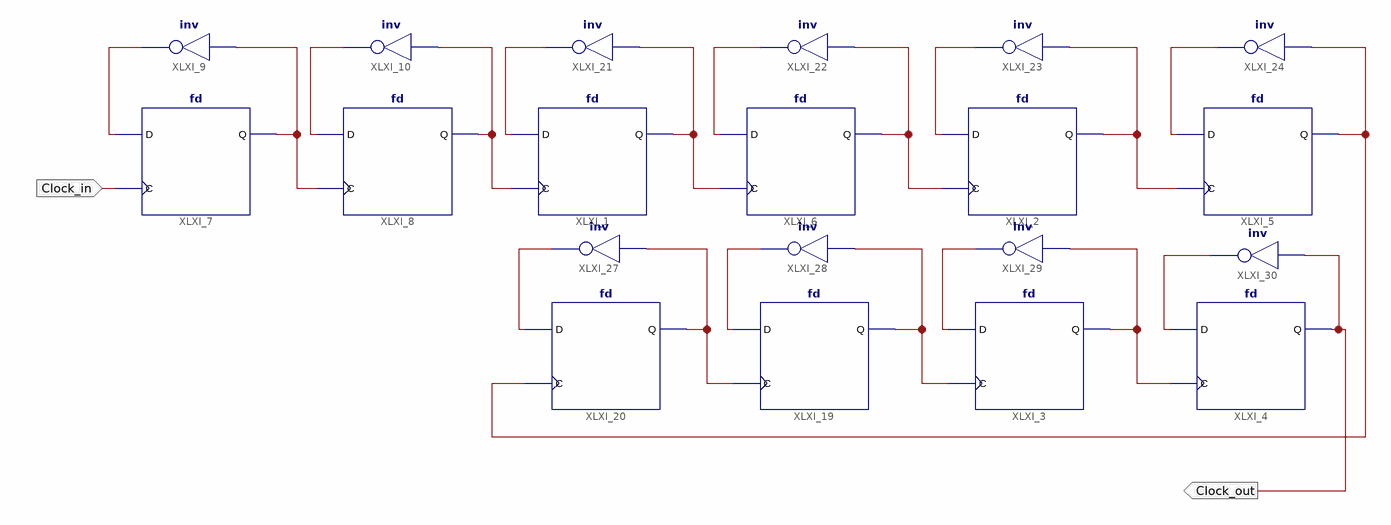
[diagram p0: schematic sheet 1]
// Xilinx ISE schematic CD3.sch (spartan6) as structural Verilog: 20 symbols, 2 ports
module CD3 (
  input  Clock_in,
  output Clock_out
);

  wire XLXN_1, XLXN_2, XLXN_3, XLXN_4, XLXN_5, XLXN_6, XLXN_7, XLXN_18, XLXN_29, XLXN_30, XLXN_31, XLXN_32,
       XLXN_33, XLXN_34, XLXN_37, XLXN_38, XLXN_39, XLXN_40, XLXN_54;

  fd XLXI_1 (.C(XLXN_2), .D(XLXN_31), .Q(XLXN_3));
  fd XLXI_2 (.C(XLXN_4), .D(XLXN_33), .Q(XLXN_5));
  fd XLXI_3 (.C(XLXN_6), .D(XLXN_39), .Q(XLXN_7));
  fd XLXI_4 (.C(XLXN_7), .D(XLXN_40), .Q(Clock_out));
  fd XLXI_5 (.C(XLXN_5), .D(XLXN_34), .Q(XLXN_54));
  fd XLXI_6 (.C(XLXN_3), .D(XLXN_32), .Q(XLXN_4));
  fd XLXI_7 (.C(Clock_in), .D(XLXN_29), .Q(XLXN_1));
  fd XLXI_8 (.C(XLXN_1), .D(XLXN_30), .Q(XLXN_2));
  not XLXI_9 (XLXN_29, XLXN_1);
  not XLXI_10 (XLXN_30, XLXN_2);
  not XLXI_21 (XLXN_31, XLXN_3);
  not XLXI_22 (XLXN_32, XLXN_4);
  not XLXI_23 (XLXN_33, XLXN_5);
  not XLXI_24 (XLXN_34, XLXN_54);
  not XLXI_27 (XLXN_37, XLXN_18);
  not XLXI_28 (XLXN_38, XLXN_6);
  not XLXI_29 (XLXN_39, XLXN_7);
  not XLXI_30 (XLXN_40, Clock_out);
  fd XLXI_19 (.C(XLXN_18), .D(XLXN_38), .Q(XLXN_6));
  fd XLXI_20 (.C(XLXN_54), .D(XLXN_37), .Q(XLXN_18));
endmodule
